# Altium schematic sheet TensoSensor_EXTRA.SchDoc
size 420 x 297 mm; DocumentNumber: Тензодатчик; SheetNumber: 2; Format: A3
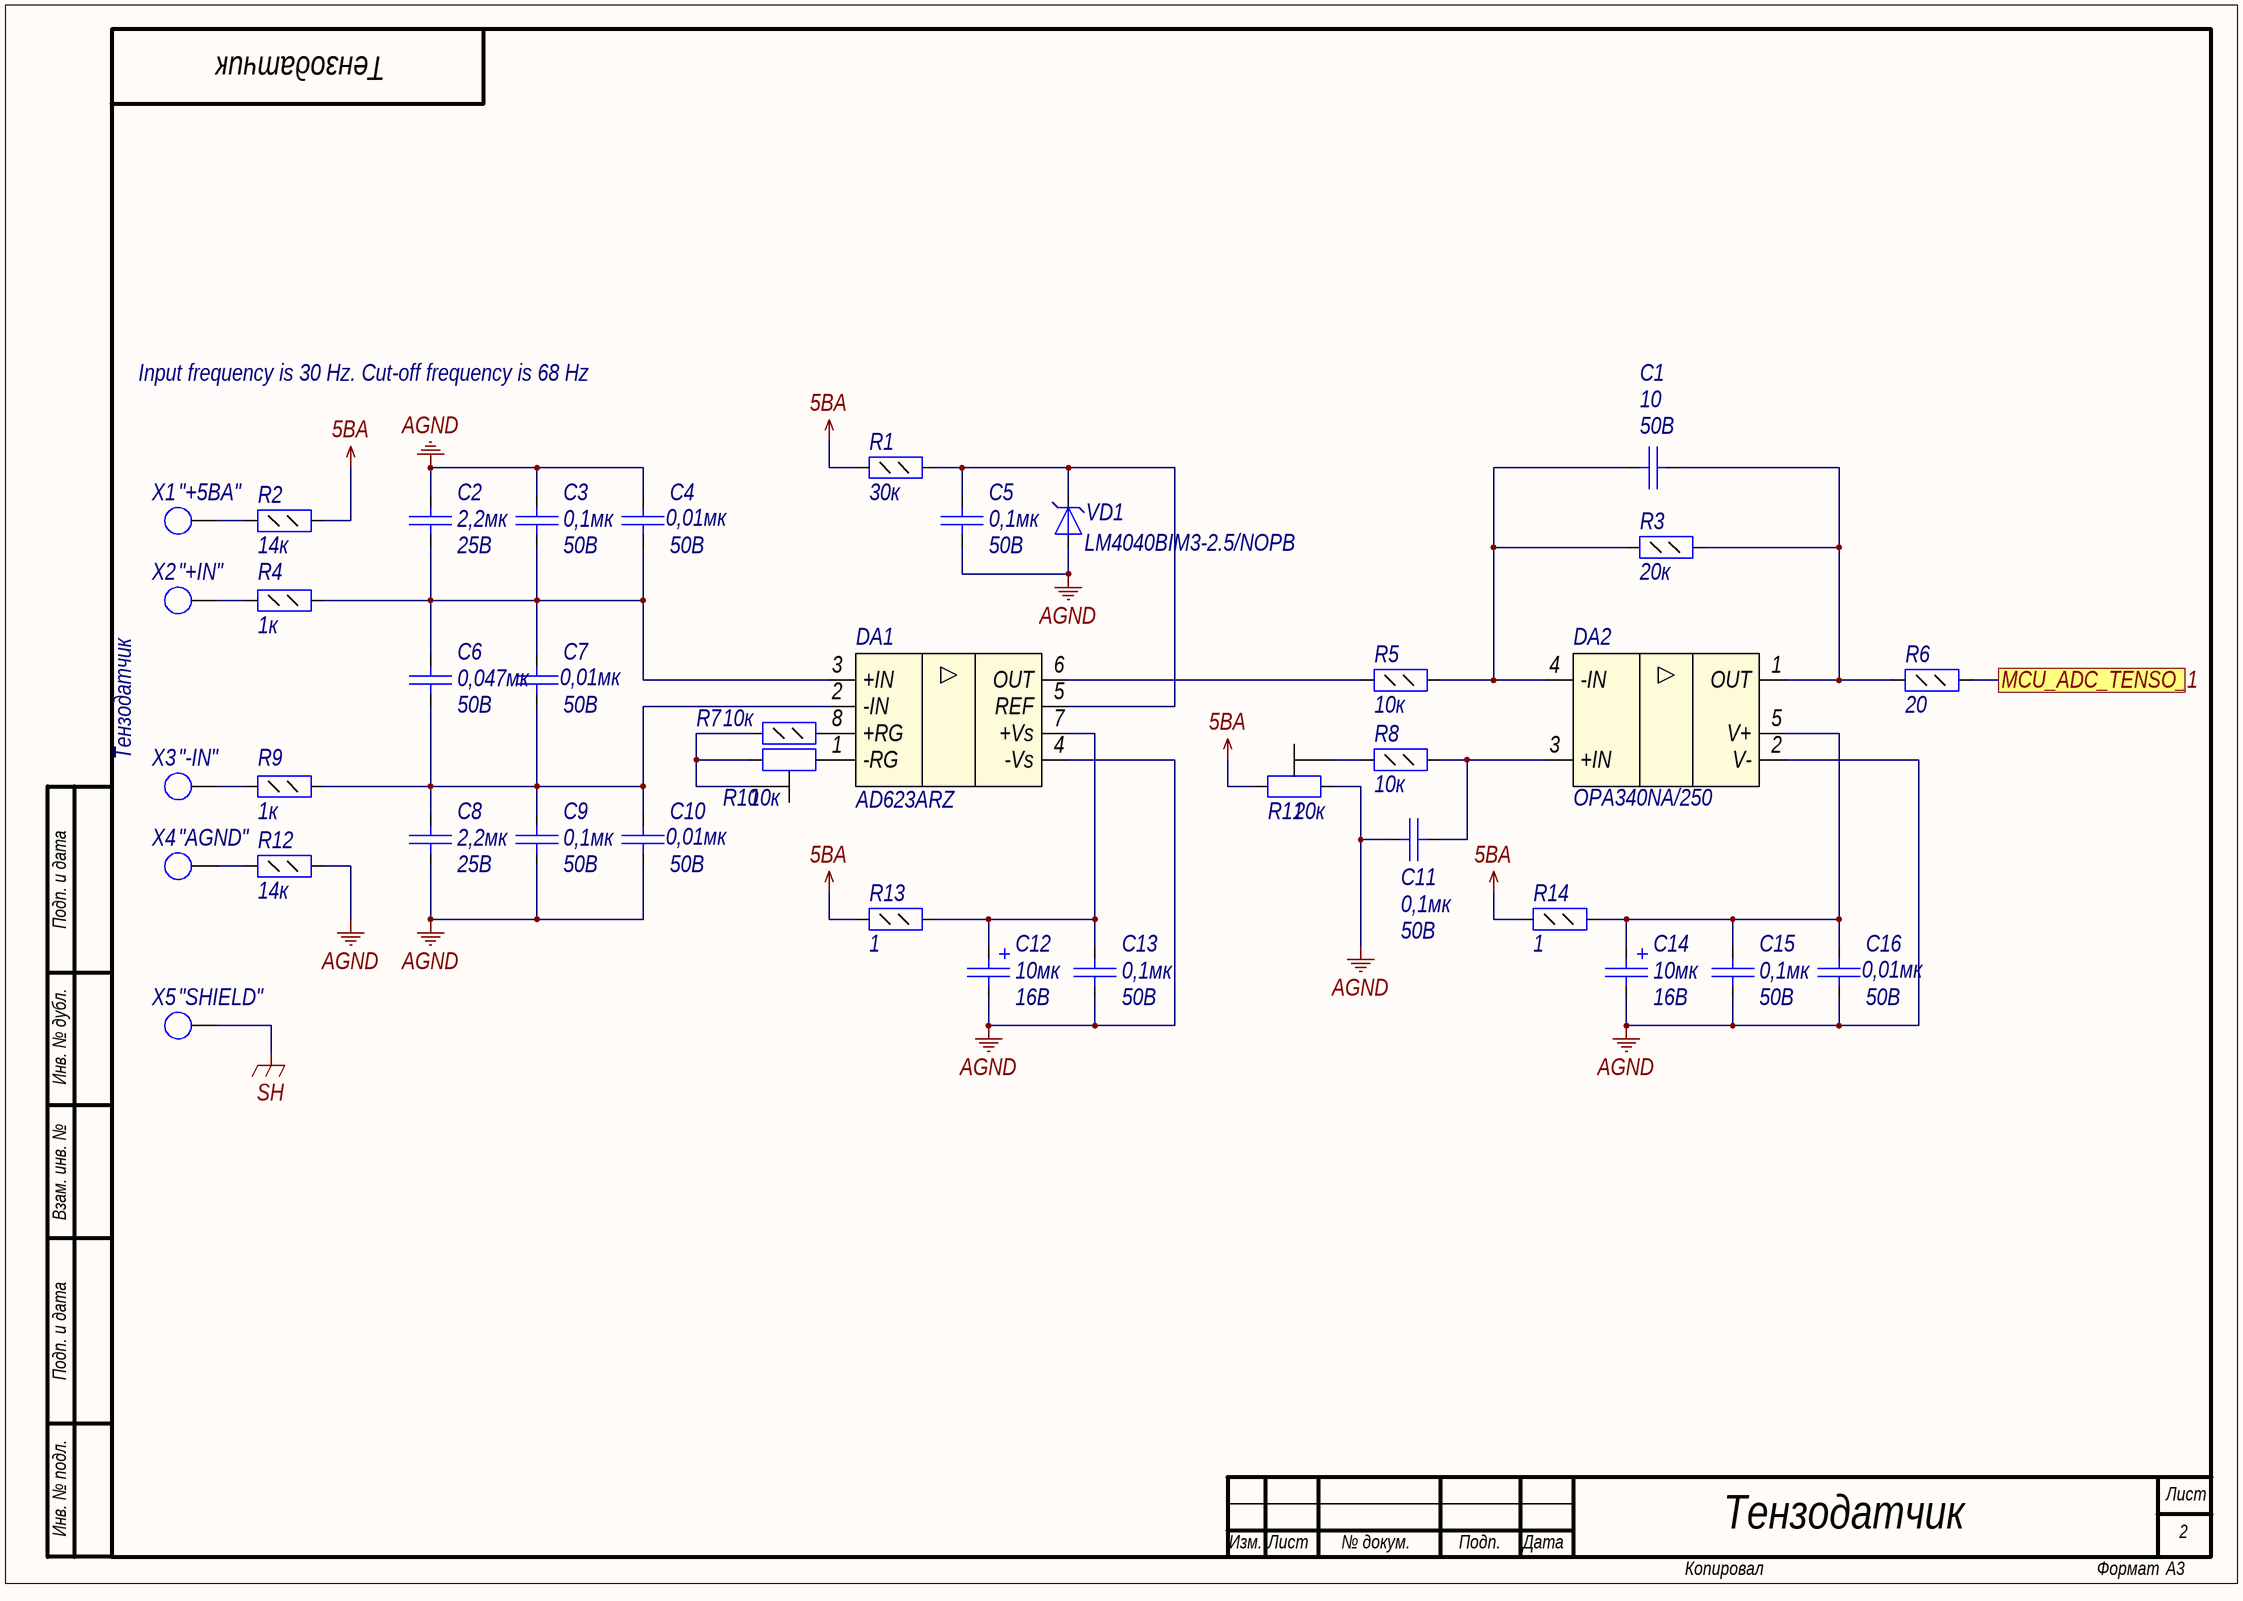
[diagram p0: TensoSensor_EXTRA.SchDoc]

## Parts
C1  Voltage: 50B  [C0603]  (hidden comment: 10)
C2  Voltage: 25B  [C0805]  (hidden comment: 2,2мк)
C3  Voltage: 50B  [C0805]  (hidden comment: 0,1мк)
C4  Voltage: 50B  [C0805]  (hidden comment: 0,01мк)
C5  Voltage: 50B  [C0805]  (hidden comment: 0,1мк)
C6  Voltage: 50B  [C0805]  (hidden comment: 0,047мк)
C7  Voltage: 50B  [C0805]  (hidden comment: 0,01мк)
C8  Voltage: 25B  [C0805]  (hidden comment: 2,2мк)
C9  Voltage: 50B  [C0805]  (hidden comment: 0,1мк)
C10  Voltage: 50B  [C0805]  (hidden comment: 0,01мк)
C11  Voltage: 50B  [C0805]  (hidden comment: 0,1мк)
C12  value 10мк  Voltage: 16В  [TANTAL CASE A]  (hidden comment: Capacitor_pol)
C13  Voltage: 50B  [C0805]  (hidden comment: 0,1мк)
C14  value 10мк  Voltage: 16В  [TANTAL CASE A]  (hidden comment: Capacitor_pol)
C15  Voltage: 50B  [C0805]  (hidden comment: 0,1мк)
C16  Voltage: 50B  [C0805]  (hidden comment: 0,01мк)
DA1  AD623ARZ  [SO8]
DA2  Part Number: OPA340NA/250  [SOT23-5]  (hidden comment: OPA340)
R1  value 30к  [R0805]  (hidden comment: Resistor_0,125Вт)
R2  value 14к  [R0805]  (hidden comment: Resistor_0,125Вт)
R3  value 20к  [R0805]  (hidden comment: Resistor_0,125Вт)
R4  value 1к  [R0805]  (hidden comment: Resistor_0,125Вт)
R5  value 10к  [R0805]  (hidden comment: Resistor_0,125Вт)
R6  value 20  [R0805]  (hidden comment: Resistor_0,125Вт)
R7  value 10к  [R0805]  (hidden comment: Resistor_0,125Вт)
R8  value 10к  [R0805]  (hidden comment: Resistor_0,125Вт)
R9  value 1к  [R0805]  (hidden comment: Resistor_0,125Вт)
R10  value 10к  [3224W]  (hidden comment: Potentiometer)
R11  value 20к  [3224W]  (hidden comment: Potentiometer)
R12  value 14к  [R0805]  (hidden comment: Resistor_0,125Вт)
R13  value 1  [R0805]  (hidden comment: Resistor_0,125Вт)
R14  value 1  [R0805]  (hidden comment: Resistor_0,125Вт)
VD1  LM4040BIM3-2.5/NOPB  [SOT23-3]
X1  SoldPoint  [1HOLE]  (value not drawn)
X2  SoldPoint  [1HOLE]  (value not drawn)
X3  SoldPoint  [1HOLE]  (value not drawn)
X4  SoldPoint  [1HOLE]  (value not drawn)
X5  SoldPoint  [1HOLE]  (value not drawn)

## Ports
MCU_ADC_TENSO_1

## Nets
5BA: R1.1 R2.2 R11.1 R13.1 R14.1
AGND: C2.2 C3.2 C4.2 C5.1 C8.1 C9.1 C10.1 C11.2 C12.2 C13.1 C14.2 C15.1 C16.1 DA1.4(-Vs) DA2.2(V-) R11.3 R12.2 VD1.2(A)
SH: X5.1
MCU_ADC_TENSO_1: R6.2 ; port MCU_ADC_TENSO_1
NetC1_1: C1.1 DA2.4(-IN) R3.1 R5.2
NetC1_2: C1.2 DA2.1(OUT) R3.2 R6.1
NetC2_1: C2.1 C3.1 C4.1 C6.2 C7.2 DA1.3(+IN) R4.2
NetC5_2: C5.2 DA1.5(REF) R1.2 VD1.1(K)
NetC6_1: C6.1 C7.1 C8.2 C9.2 C10.2 DA1.2(-IN) R9.2
NetC11_1: C11.1 DA2.3(+IN) R8.2
NetC12_1: C12.1 C13.2 DA1.7(+Vs) R13.2
NetC14_1: C14.1 C15.2 C16.2 DA2.5(V+) R14.2
NetDA1_1: DA1.1(-RG) R10.1
NetDA1_6: DA1.6(OUT) R5.1
NetDA1_8: DA1.8(+RG) R7.2
NetR2_1: R2.1 X1.1
NetR4_1: R4.1 X2.1
NetR7_1: R7.1 R10.2 R10.3
NetR8_1: R8.1 R11.2
NetR9_1: R9.1 X3.1
NetR12_1: R12.1 X4.1

## Notes on the sheet
- Input frequency is 30 Hz. Cut-off frequency is 68 Hz
- "+5BA"
- "+IN"
- Тензодатчик
- "-IN"
- "AGND"
- Подп. и дата
- Инв. № дубл.
- (near X5) "SHIELD"
- Взам. инв. №
- Инв. № подл.
- Лист
- Изм.
- № докум.
- Подп.
- Дата
- Копировал
- Формат

## Library data of the parts
C1 = cap71: Конденсатор; Part Name: Ceramic; Manufacture: Murata; Part Number: GRM1885C1H100J; id: cap71; TKE: NP0; Value: 10
C2 C8 = cap152: Конденсатор; Part Name: Ceramic; Manufacture: Murata; Part Number: GRM21BR71E225K; id: cap152; TKE: X7R; Value: 2,2мк
C3 C5 C9 C11 C13 C15 = cap141: Конденсатор; Part Name: Ceramic; Manufacture: Murata; Part Number: GRM21BR71H104K**; id: cap141; TKE: X7R; Value: 0,1мк
C4 C7 C10 C16 = cap136: Конденсатор; Part Name: Ceramic; Manufacture: Murata; Part Number: GRM216R71H103K; id: cap136; TKE: X7R; Value: 0,01мк
C6 = cap140: Конденсатор; Part Name: Ceramic; Manufacture: Murata; Part Number: GRM21BR71H473K; id: cap140; TKE: X7R; Value: 0,047мк
C12 C14 = cap199: Конденсатор полярный; Part Name: Tantal; Manufacture: Vishay; Part Number: 293D106X9016A2TE3; id: cap199
DA1 = amp4: Low Cost Low Power  Instrumentation Amplifier; id: amp4; Bandwidth: 0,8МГц; Offset voltage: 0,2; Channels: 1; Power Single Supply: 2,7 - 12; Power Dual Supply: (+-)2,5 - (+-)6; Part Name: Instrumentation Amplifier; Part Number: AD623ARZ
DA2 = amp23: Operational Amplifiers / MicroAmplifier; Manufacture: Texas Instruments; id: amp23; Rail-to-rail: yes; Supply Voltage: 2,7-5,5B; Supply Current max: 0,75mA; Bandwidth: 5,5MHz; Input Bias Current: 0,2pA; CMRR: 80dB; PSRR: 100dB; Offset voltage: 150uB; Channels: 1; Part Name: Operational Amplifiers MicroAmplifier
R1 = res112: Резистор; Manufacture: Yageo; Part Number: RC0805FR-0730KL; id: res112; Accuracy: 0,01; Part Name: Resistor; Power: 0,125Вт
R2 R12 = res1218: Резистор; Manufacture: Yageo; Part Number: RC0805FR-0714KL; Accuracy: 0,01; id: res1218; Part Name: Resistor; Power: 0,125Вт
R3 = res108: Резистор; Manufacture: Yageo; Part Number: RC0805FR-0720KL; id: res108; Accuracy: 0,01; Part Name: Resistor; Power: 0,125Вт
R4 R9 = res76: Резистор; Manufacture: Yageo; Part Number: RC0805FR-071KL; id: res76; Accuracy: 0,01; Part Name: Resistor; Power: 0,125Вт
R5 R7 R8 = res101: Резистор; Manufacture: Yageo; Part Number: RC0805FR-0710KL; id: res101; Accuracy: 0,01; Part Name: Resistor; Power: 0,125Вт
R6 = res32: Резистор; Manufacture: Yageo; Part Number: RC0805FR-0720RL; id: res32; Accuracy: 0,01; Part Name: Resistor; Power: 0,125Вт
R10 = res1264: Manufacture: Bourns; Part Number: 3224W-1-103E; Accuracy: 0,1; Power: 0,25Вт; id: res1264; Part Name: Potentiometer
R11 = res1265: Manufacture: Bourns; Part Number: 3224W-1-203E; Accuracy: 0,1; Power: 0,25Вт; id: res1265; Part Name: Potentiometer
R13 R14 = res1: Резистор; Manufacture: Yageo; Part Number: RC0805FR-071RL; id: res1; Accuracy: 0,01; Part Name: Resistor; Power: 0,125Вт
VD1 = LM4040BIM3-2.5/NOPB: Прецезионный источник опорного напряжения; Part Name: Precision Micropower Shunt Voltage Reference; Voltage min stabilize: 2,5B; Accuracy: 0,002; Output current: 15mA; Footprint: sot23-3; Part Number: LM4040BIM3-2.5/NOPB
X1-X5 = connect205: Part Name: Place for soldering; Contact_1: Contact_1; id: connect205